# EAGLE design Papierski_Dice_3 (EAGLE 7.1.0)
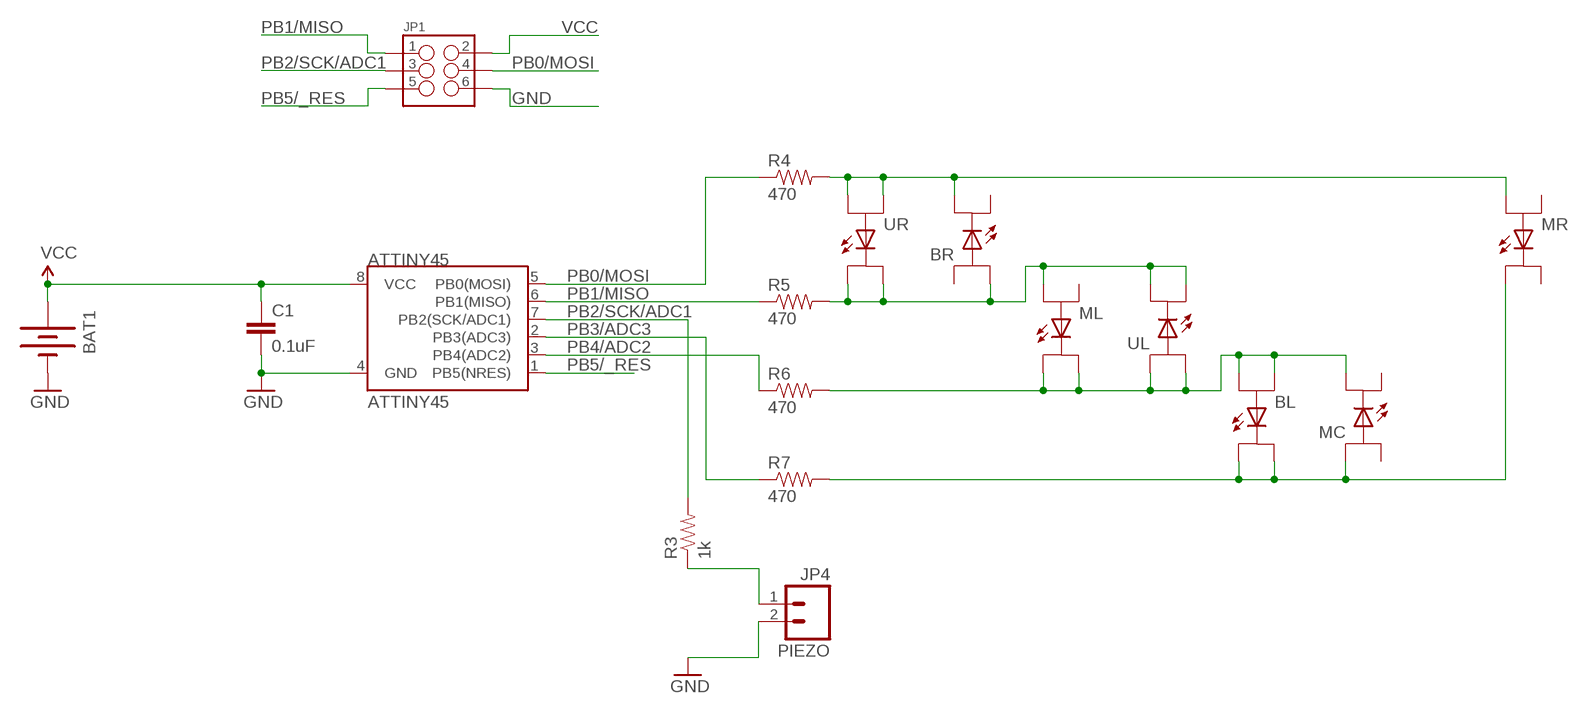
[diagram p0: schematic, sheet 1]

## Parts
ATTINY45  ATTINY45  ATTINY45TINY85-20-SMT  [SO08-EIAJ]
BAT1  BATTERY20PTH  [BATTCOM_20MM_PTH]
BL  LED_PIRANHA_5MM_SNGLS  [LED_PIRANHA_5MM_SNGL_SMD]
BR  LED_PIRANHA_5MM_SNGLS  [LED_PIRANHA_5MM_SNGL_SMD]
C1  0.1uF  CAP0805  [0805]
JP1  M03X2NO_SILK  [2X3-NS]
MC  LED_PIRANHA_5MM_SNGLS  [LED_PIRANHA_5MM_SNGL_SMD]
ML  LED_PIRANHA_5MM_SNGLS  [LED_PIRANHA_5MM_SNGL_SMD]
MR  LED_PIRANHA_5MM_SNGLS  [LED_PIRANHA_5MM_SNGL_SMD]
PIEZO  JP4  M02PTH  [1X02]
R3  1k  RESISTORAXIAL-0.3  [AXIAL-0.3]
R4  470  RESISTORAXIAL-0.3  [AXIAL-0.3]
R5  470  RESISTORAXIAL-0.3  [AXIAL-0.3]
R6  470  RESISTORAXIAL-0.3  [AXIAL-0.3]
R7  470  RESISTOR0805-RES  [0805]
UL  LED_PIRANHA_5MM_SNGLS  [LED_PIRANHA_5MM_SNGL_SMD]
UR  LED_PIRANHA_5MM_SNGLS  [LED_PIRANHA_5MM_SNGL_SMD]

## Nets
GND: ATTINY45.4(GND) BAT1.2(-) C1.2 JP1.6 PIEZO.2
N$1: BR.K1(C1) MR.A1 R4.P$2 UR.A1 UR.A2
N$2: BL.A1 BL.A2 MC.K1(C1) ML.K1(C1) ML.K2(C2) R6.P$2 UL.A1 UL.A2
N$3: BL.K1(C1) BL.K2(C2) MC.A2 MR.K2(C2) R7.2
N$4: PIEZO.1 R3.P$1
N$6: BR.A1 ML.A1 R5.P$2 UL.K1(C1) UL.K2(C2) UR.K1(C1) UR.K2(C2)
PB0/MOSI: ATTINY45.5(PB0(MOSI)) JP1.4 R4.P$1
PB1/MISO: ATTINY45.6(PB1(MISO)) JP1.1 R5.P$1
PB2/SCK/ADC1: ATTINY45.7(PB2(SCK/ADC1)) JP1.3 R3.P$2
PB3/ADC3: ATTINY45.2(PB3(ADC3)) R7.1
PB4/ADC2: ATTINY45.3(PB4(ADC2)) R6.P$1
PB5/_RES: ATTINY45.1(PB5(NRES)) JP1.5
VCC: ATTINY45.8(VCC) BAT1.1(+) C1.1 JP1.2
Unconnected: BR.A2 BR.K2(C2) MC.A1 MC.K2(C2) ML.A2 MR.A2 MR.K1(C1)

## Library data of the parts
ATTINY45 = SparkFun-DigitalIC:ATTINY45: Atmel 8-pin 2/4/8kB flash uC; PROD_ID: IC-09092; VALUE: Tiny85-20-SMT
BAT1 = SparkFun-Electromechanical:BATTERY: Battery Holders Various common sizes : AA, AAA, 20mm coin cell and 12mm coin cell. 20MM_4LEGS, BATT-10373
BL BR MC ML MR UL UR = jpg_6v3:LED_PIRANHA_5MM_SNGL
C1 = SparkFun-Passives:CAP: Capacitor Standard 0603 ceramic capacitor, and 0.1" leaded capacitor.
JP1 = SparkFun-Connectors:M03X2: 2x3 .1" header. Shrouded, with keying- CONN-10681 SMT- CONN-11415 Pogo pins- HW-11044
PIEZO = SparkFun-Connectors:M02: Standard 2-pin 0.1" header. Use with - straight break away headers ( PRT-00116) - right angle break away headers (PRT-00553) - swiss pins (PRT-00743) - machine pins (PRT-00117) - female headers (PRT-00115) Molex polarized connector foot print use with: PRT-08233 with associated crimp pins and housings. 2.54_SCREWTERM for use with PRT-10571. 3.5mm Screw Terminal footprints for PRT-08084 5mm Screw Terminal footprints for use with PRT-08433
R3-R7 = SparkFun-Passives:RESISTOR: Resistor Basic schematic elements and footprints for 0603, 1206, and PTH resistors.

## Board
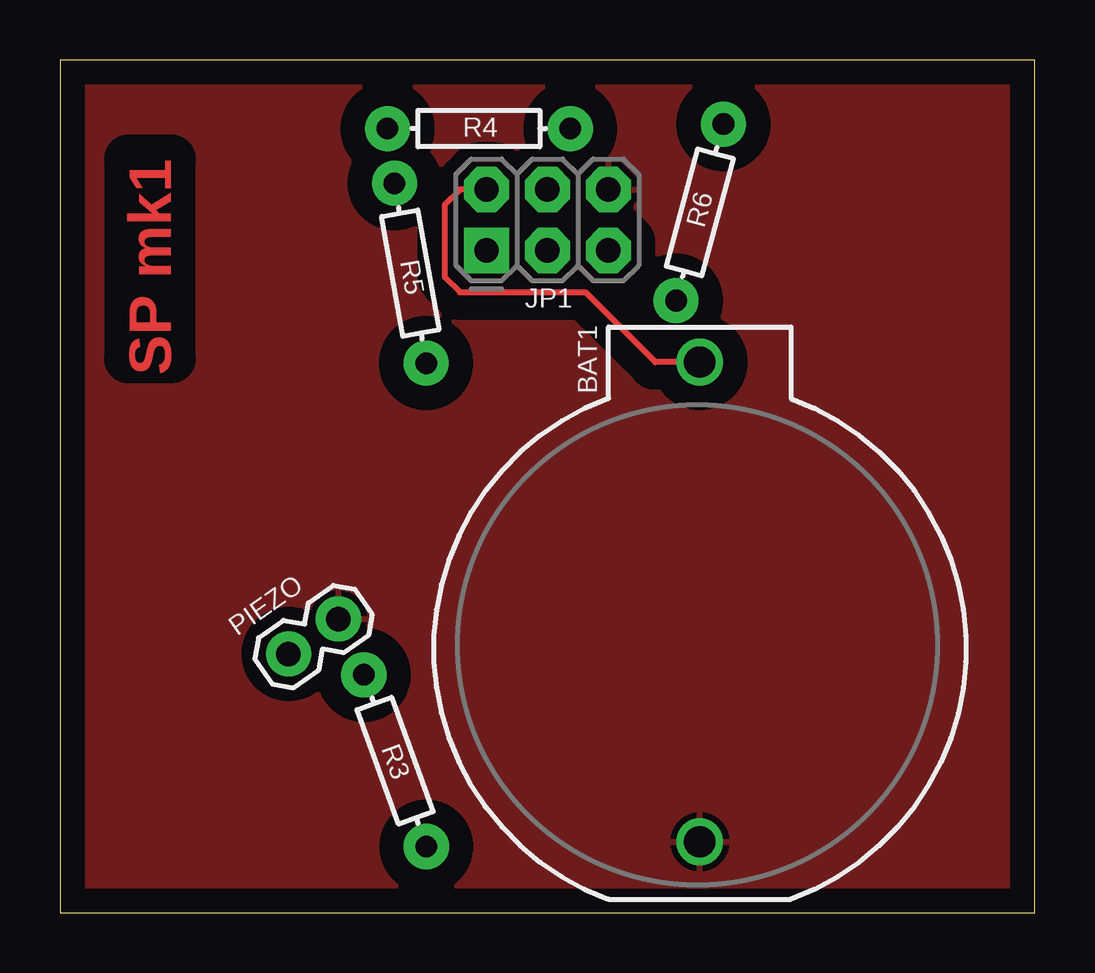
[diagram p1: board, top side]
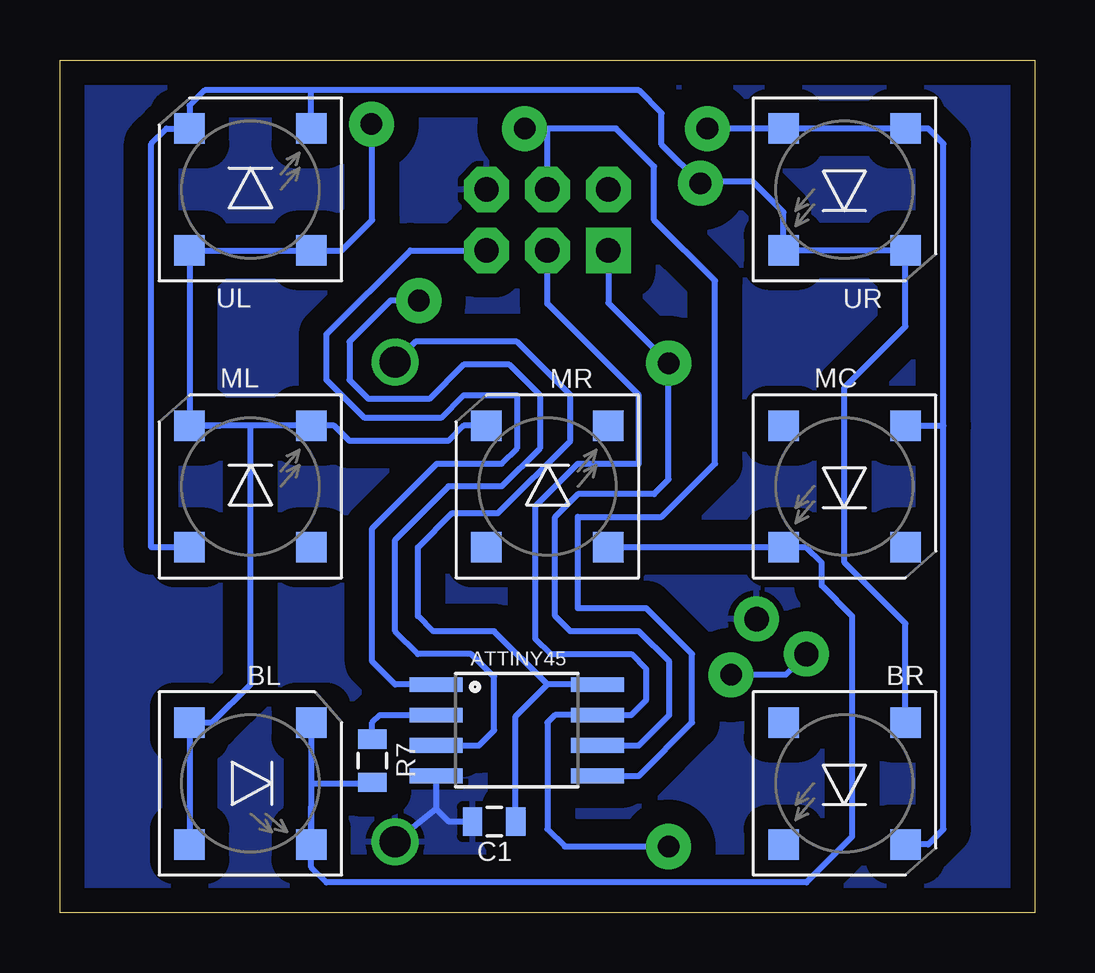
[diagram p2: board, bottom side, seen from below]

Size 40.64 x 35.56 mm. Coordinates in mm from the lower left corner, seen from the top.
Outline: 0,0 40.64,0 40.64,35.56 0,35.56 0,0
Copper layers (1*16): Top 0.035mm / dielectric 1.5mm / Bottom 0.035mm
Design rules "default *": minimum track width 10mil, minimum drill 24mil, track to track 10mil, track to pad 10mil, pad to pad 10mil, via to via 10mil, smd to smd 10mil, copper to edge 40mil, drill to drill 10mil, minimum pad ring 10mil, minimum via ring 8mil, stop-mask expansion 4mil, vias tented up to drill 0mil, thermal gap 10mil

### Footprints (pad centres in the part's own frame; a part is rotated, then mirrored left to right if it is on the bottom)
SO08-EIAJ = smd 0.61 x 2.21: 1 -1.905,-3.378; 2 -0.635,-3.378; 3 0.635,-3.378; 4 1.905,-3.378; 5 1.905,3.353; 6 0.635,3.353; 7 -0.635,3.353; 8 -1.905,3.353
BATTCOM_20MM_PTH = drill 1.3: 1 11.85,0; 2 -8.15,0
LED_PIRANHA_5MM_SNGL_SMD = smd 1.27 x 1.27: A1 -2.54,-2.54; A2 2.54,-2.54; K1 -2.54,2.54; K2 2.54,2.54
0805 = smd 0.8 x 1.2: 1 -0.9,0; 2 0.9,0
2X3-NS = drill 1.016 pad 1.88 square: 1 -2.54,-1.27 | drill 1.016 pad 1.88 octagon: 2 -2.54,1.27; 3 0,-1.27; 4 0,1.27; 5 2.54,-1.27; 6 2.54,1.27
1X02 = drill 1.016 pad 1.88: 1 0,0; 2 2.54,0
AXIAL-0.3 = drill 0.9 pad 1.88: P$1 -3.81,0; P$2 3.81,0

### Placement (x,y rotation side)
ATTINY45  21.59,7.62 270 bottom
BAT1  26.67,11.11 90 top
BL  32.7,5.4 270 bottom
BR  7.94,5.4 180 bottom
C1  22.54,3.81 180 bottom
JP1  20.32,28.89 0 top
MC  20.32,17.78 0 bottom
ML  32.7,17.78 0 bottom
MR  7.94,17.78 180 bottom
PIEZO  9.53,10.79 35 top
R3  13.97,6.35 290 top
R4  17.46,32.7 180 top
R5  14.61,26.67 100 top
R6  26.67,29.21 75 top
R7  27.62,6.35 270 bottom
UL  32.7,30.16 0 bottom
UR  7.94,30.16 180 bottom

### Tracks (layer width: path | path; a pad name or v marks a point on that pad's centre or on a via)
GND
  Bottom 0.254: ATTINY45.4 24.97,4.35 | 24.97,4.35 BAT1.2 | C1.2 24.43,3.81 24.97,4.35
  pour Top (isolate 1.016): 0,35.56 40.64,35.56 40.64,0 0,0
  pour Bottom (isolate 1.016): 0,35.56 40.64,35.56 40.64,0 0,0
N$1
  Bottom 0.254: 3.81,20.32 3.81,3.49 4.45,2.86 BR.K1 | MR.A1 3.81,20.32 | 3.81,20.32 3.81,32.07 4.45,32.7 UR.A1 UR.A2 R4.P$2
N$2
  Bottom 0.254: ML.K1 UL.A1 UL.A2 28.89,27.62 27.62,28.89 27.62,32.86 R6.P$2 | ML.K1 33.97,20.32 | 32.7,20.32 ML.K2 29.21,20.32 28.57,19.68 24.45,19.68 23.81,20.32 MC.K1 | 32.7,20.32 ML.K1 | BL.A2 BL.A1 34.29,7.94 32.7,9.53 32.7,20.32
N$3
  Bottom 0.254: BL.K2 30.16,1.91 29.53,1.27 9.53,1.27 7.62,3.17 7.62,12.38 8.89,13.65 8.89,14.61 9.53,15.24 MR.K2 MC.A2 | BL.K2 30.16,4.45 | 30.16,5.4 27.68,5.4 R7.2 | BL.K1 30.16,5.4 | 30.16,5.4 BL.K2
N$4
  Bottom 0.254: PIEZO.1 10.39,9.93 R3.P$1
N$6
  Bottom 0.254: ML.A1 36.83,15.24 36.83,32.07 36.2,32.7 UL.K1 35.24,33.66 34.61,34.29 30.16,34.29 | 30.16,34.29 16.51,34.29 15.56,33.34 15.56,32.04 R5.P$2 13.89,30.48 11.75,30.48 10.48,29.21 UR.K2 UR.K1 5.4,24.45 7.94,21.91 7.94,14.61 5.4,12.06 BR.A1 | UL.K2 30.16,34.29
PB0/MOSI
  Bottom 0.254: JP1.4 20.32,32.7 | ATTINY45.5 16.51,5.71 14.29,7.94 14.29,10.79 16.19,12.7 19.05,12.7 19.05,16.51 15.56,16.51 13.34,18.73 13.34,26.35 15.88,28.89 15.88,31.11 17.46,32.7 20.32,32.7 | 20.32,32.7 R4.P$1
PB1/MISO
  Bottom 0.254: ATTINY45.6 16.51,6.99 15.24,8.26 15.24,10.48 16.51,11.75 19.37,11.75 20,12.38 20,16.51 19.05,17.46 15.88,17.46 15.27,18.07 R5.P$1 17.78,25.43 JP1.1
PB2/SCK/ADC1
  Bottom 0.254: R3.P$2 19.6,2.77 20.32,3.49 20.32,7.94 20,8.26 ATTINY45.7 16.83,8.26 16.19,8.89 16.19,10.16 16.83,10.79 20.19,10.79 20.83,11.43 20.83,16.95 19.05,18.73 16.51,18.73 16.51,21.59 20.32,25.4 JP1.3
PB3/ADC3
  Bottom 0.254: R7.1 27.62,7.94 27.3,8.26 ATTINY45.2
PB4/ADC2
  Bottom 0.254: ATTINY45.3 23.18,6.99 22.54,7.62 22.54,9.84 23.5,10.79 25.72,10.79 26.67,11.75 26.67,15.56 24.45,17.78 22.23,17.78 20.64,19.37 20.64,21.59 21.91,22.86 23.81,22.86 25.24,21.43 27.78,21.43 28.57,22.23 28.57,23.81 26.86,25.53 R6.P$1
PB5/_RES
  Bottom 0.254: JP1.5 26.04,27.62 29.53,24.13 29.53,22.23 27.94,20.64 24.77,20.64 23.81,21.59 21.59,21.59 21.59,19.37 22.23,18.73 24.92,18.73 27.62,16.03 27.62,10.48 26.67,9.53 ATTINY45.1
VCC
  Top 0.254: JP1.2 16.67,30.16 16.03,29.53 16.03,26.51 16.67,25.88 21.91,25.88 24.82,22.96 BAT1.1
  Bottom 0.254: C1.1 21.64,8.2 20.32,9.53 | ATTINY45.8 20.32,9.53 | BAT1.1 25.82,23.81 21.59,23.81 19.37,21.59 19.37,19.68 22.38,16.67 24.29,16.67 25.72,15.24 25.72,12.38 25.08,11.75 22.54,11.75 20.32,9.53

### Text on the board
Top: SP mk1